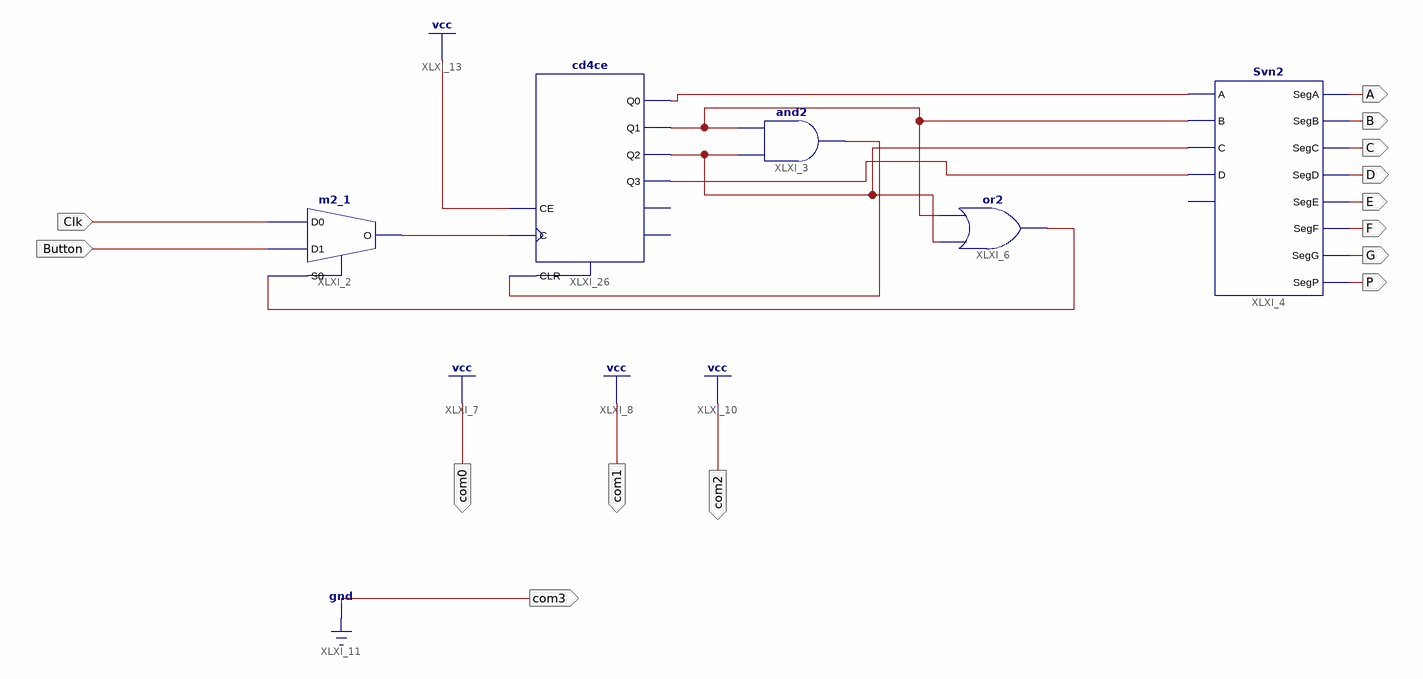
[diagram p0: schematic sheet 1]
// Xilinx ISE schematic res.sch (spartan6) as structural Verilog: 5 symbols, 14 ports
module res (
  input  Button,
  input  Clk,
  output com0,
  output com1,
  output com2,
  output com3,
  output B,
  output C,
  output D,
  output E,
  output F,
  output G,
  output P,
  output A
);

  wire XLXN_1, XLXN_6, XLXN_9, XLXN_24, XLXN_25, XLXN_26, XLXN_93;

  m2_1 XLXI_2 (.D0(Clk), .D1(Button), .S0(XLXN_26), .O(XLXN_1));
  and XLXI_3 (XLXN_9, XLXN_6, XLXN_24);
  Svn2 XLXI_4 (
    .A(XLXN_93), .B(XLXN_24), .C(XLXN_6), .D(XLXN_25), .SegA(A), .SegB(B), .SegC(C), .SegD(D), .SegE(E),
    .SegF(F), .SegG(G), .SegP(P));  // open: P
  or XLXI_6 (XLXN_26, XLXN_6, XLXN_24);
  cd4ce XLXI_26 (
    .C(XLXN_1), .CE(1'b1), .CLR(XLXN_9), .Q0(XLXN_93), .Q1(XLXN_24), .Q2(XLXN_6), .Q3(XLXN_25));  // open: CEO, TC

  assign com0 = 1'b1;
  assign com1 = 1'b1;
  assign com2 = 1'b1;
  assign com3 = 1'b0;
endmodule
